# Altium schematic sheet SAMA7D65_PMIC.SchDoc
size A3; SheetNumber: 6; SheetTotal: 23
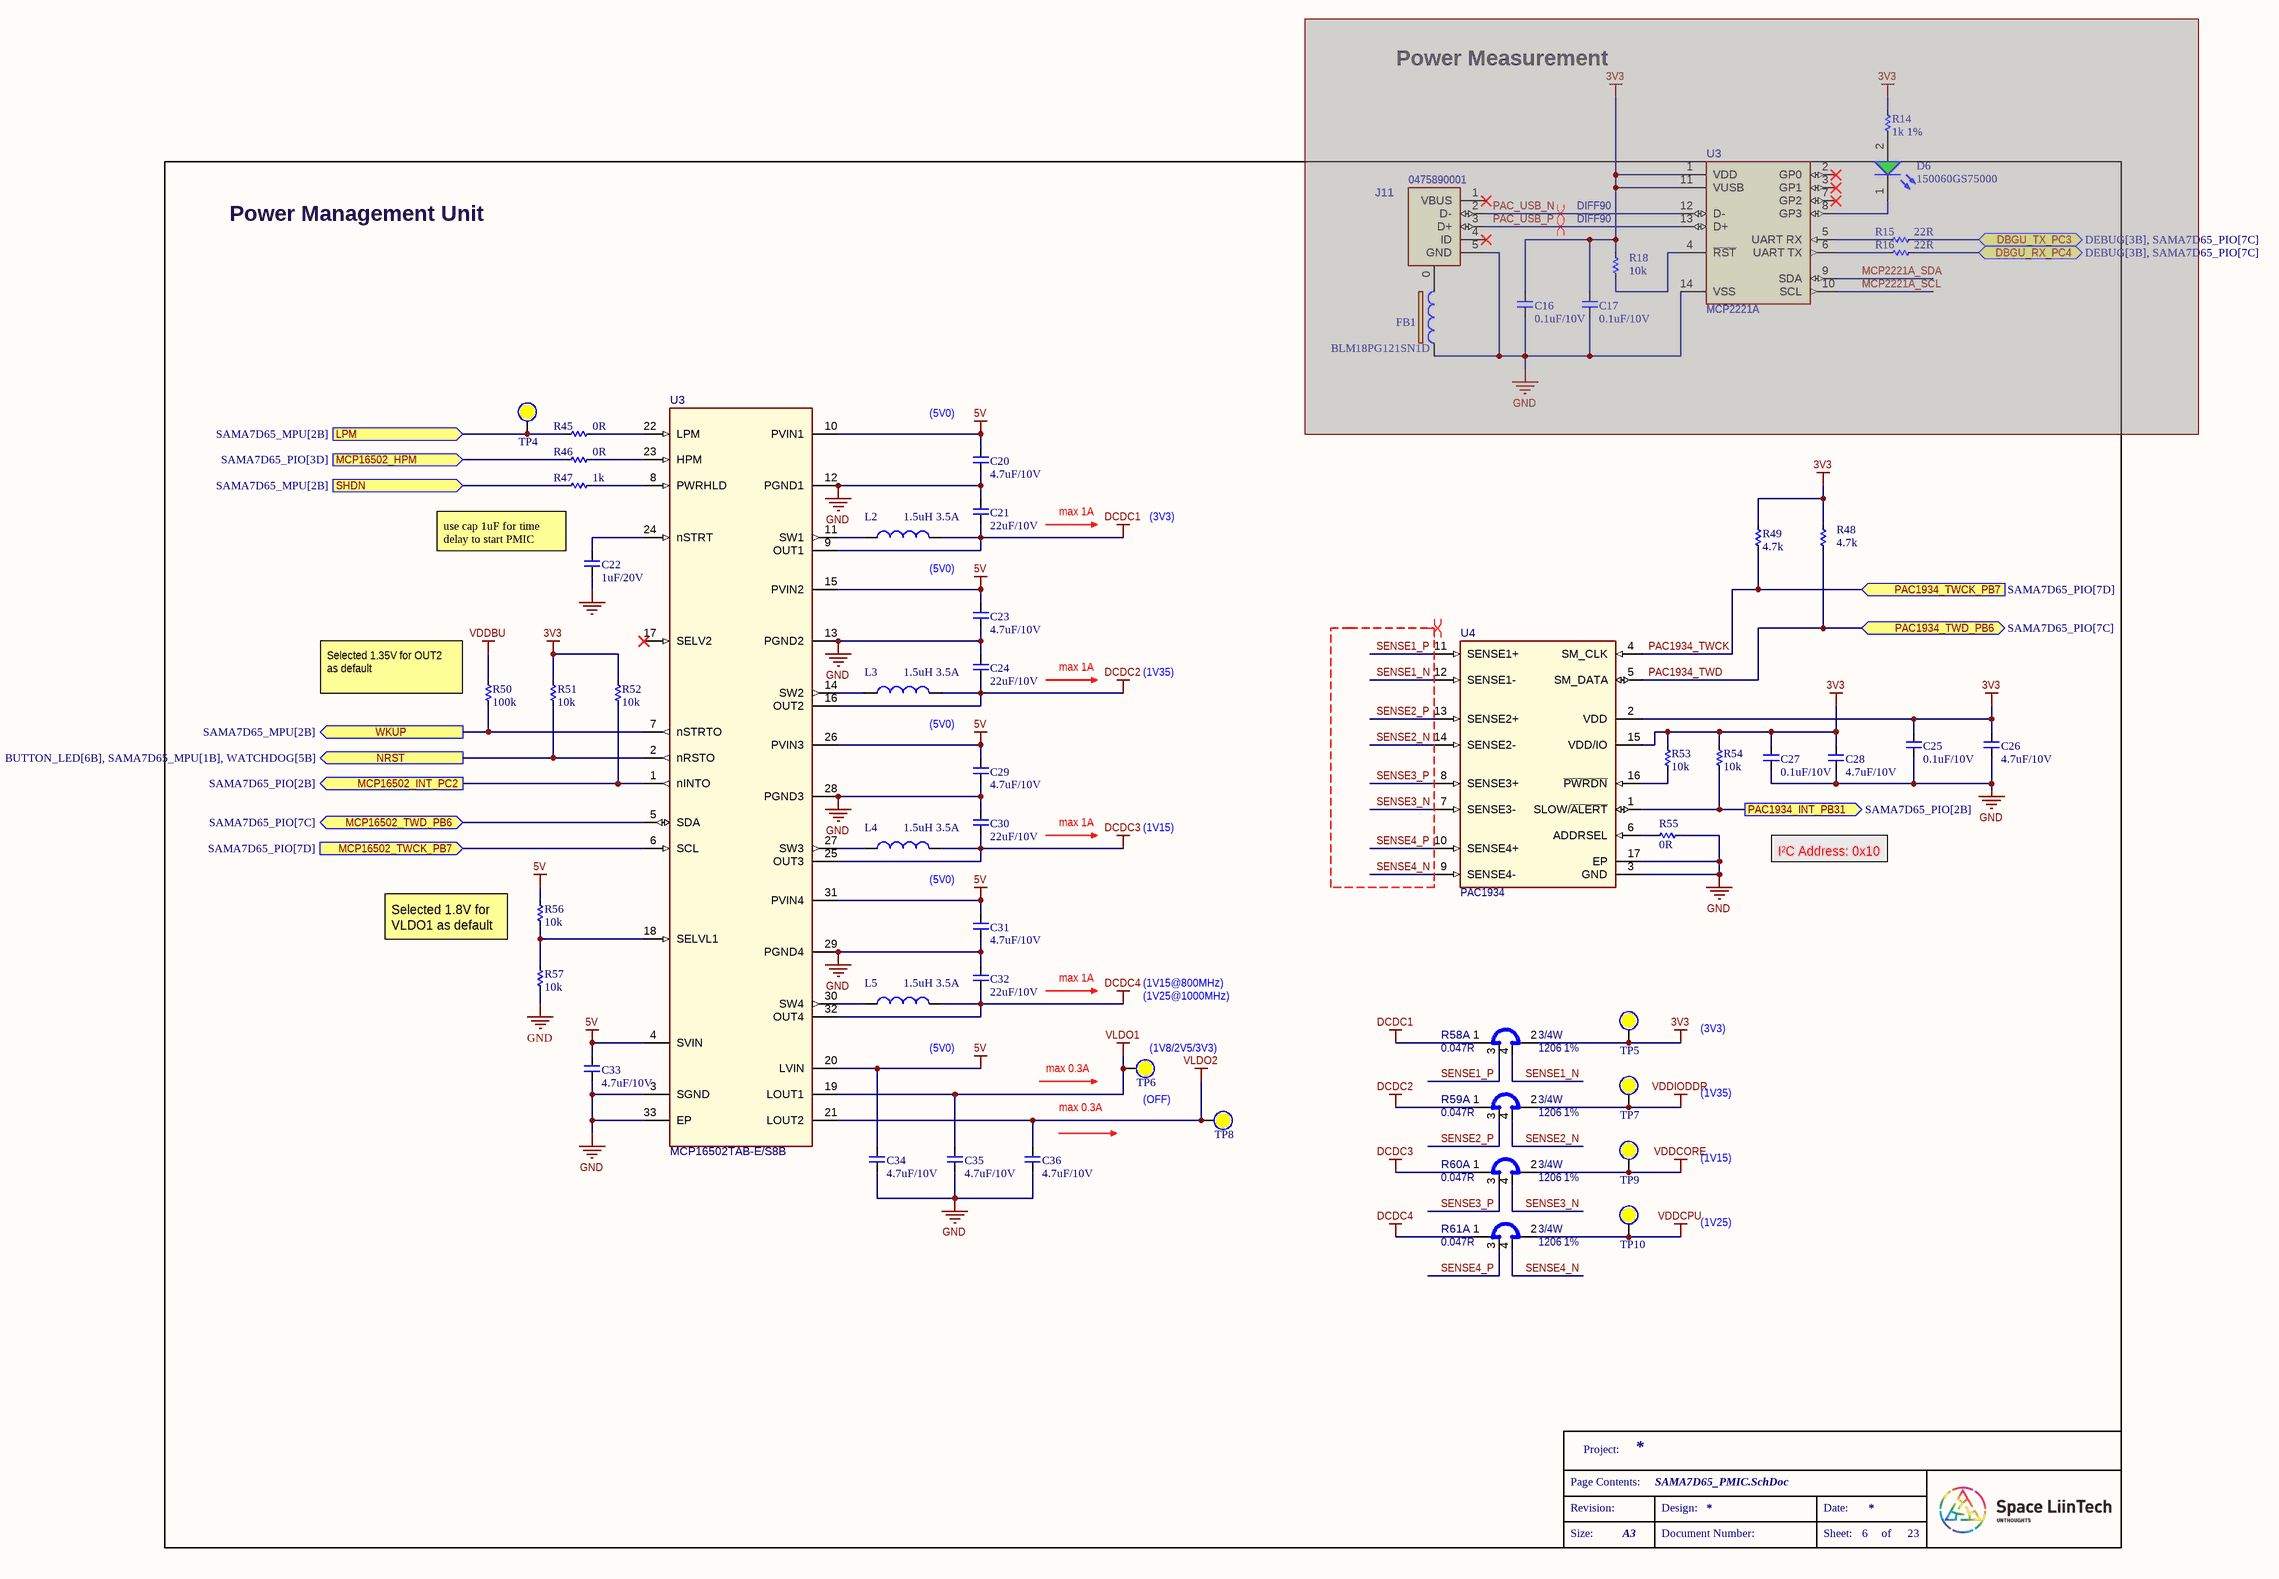
[diagram p0: SAMA7D65_PMIC.SchDoc]

## Parts
(Parts that share a designator on the sheet are numbered #1, #2 ... from top to bottom, then left to right.)
C16  0.1uF/10V  [CAP_C_1005X60]  (masked out: inside a compile mask, not in the netlist)
C17  0.1uF/10V  [CAP_C_1005X60]  (masked out: inside a compile mask, not in the netlist)
C20  4.7uF/10V  [CAP_C_1005X50_L]
C21  22uF/10V  [CAP_C_1608X80]
C22  1uF/20V  [CAP_C_1005X50_L]
C23  4.7uF/10V  [CAP_C_1005X50_L]
C24  22uF/10V  [CAP_C_1608X80]
C25  0.1uF/10V  [CAP_C_1005X50_L]
C26  4.7uF/10V  [CAP_C_1005X50_L]
C27  0.1uF/10V  [CAP_C_1005X50_L]
C28  4.7uF/10V  [CAP_C_1005X50_L]
C29  4.7uF/10V  [CAP_C_1005X50_L]
C30  22uF/10V  [CAP_C_1608X80]
C31  4.7uF/10V  [CAP_C_1005X50_L]
C32  22uF/10V  [CAP_C_1608X80]
C33  4.7uF/10V  [CAP_C_1005X50_L]
C34  4.7uF/10V  [CAP_C_1005X50_L]
C35  4.7uF/10V  [CAP_C_1005X50_L]
C36  4.7uF/10V  [CAP_C_1005X50_L]
D6  150060GS75000  [LED-0603-GREEN]  (masked out: inside a compile mask, not in the netlist)
FB1  BLM18PG121SN1D  [IND_BLM18_0603_MUR]  (masked out: inside a compile mask, not in the netlist)
J11  value 0475890001  [CON_USB_Micro-AB_SMD_RA_MOLEX_0475890001]  (hidden comment: CON USB2.0 Mini_Micro)  (masked out: inside a compile mask, not in the netlist)
L2  1.5uH 3.5A  [IND_C_1008]
L3  1.5uH 3.5A  [IND_C_1008]
L4  1.5uH 3.5A  [IND_C_1008]
L5  1.5uH 3.5A  [IND_C_1008]
R14  1k 1%  [RES_C_1005x30_L]  (masked out: inside a compile mask, not in the netlist)
R15  22R  [RES_C_1005x30_L]  (masked out: inside a compile mask, not in the netlist)
R16  22R  [RES_C_1005x30_L]  (masked out: inside a compile mask, not in the netlist)
R18  10k  [RES_C_1005x30_L]  (masked out: inside a compile mask, not in the netlist)
R45  0R  [RES_C_1005x30_L]
R46  0R  [RES_C_1005x30_L]
R47  1k  [RES_C_1005x30_L]
R48  4.7k  [RES_C_1005x30_L]
R49  4.7k  [RES_C_1005x30_L]
R50  100k  [RES_C_1005x30_L]
R51  10k  [RES_C_1005x30_L]
R52  10k  [RES_C_1005x30_L]
R53  10k  [RES_C_1005x30_L]
R54  10k  [RES_C_1005x30_L]
R55  0R  [RES_C_1005x30_L]
R56  10k  [RES_C_1005x30_L]
R57  10k  [RES_C_1005x30_L]
R58  value 0.047R  Package: 1206  Tolerance: 1%  Power: 3/4W  [RES_C_1206_SHUNT]  (hidden comment: Shunt 4 Pin)  (part A of 2)
R59  value 0.047R  Package: 1206  Tolerance: 1%  Power: 3/4W  [RES_C_1206_SHUNT]  (hidden comment: Shunt 4 Pin)  (part A of 2)
R60  value 0.047R  Package: 1206  Tolerance: 1%  Power: 3/4W  [RES_C_1206_SHUNT]  (hidden comment: Shunt 4 Pin)  (part A of 2)
R61  value 0.047R  Package: 1206  Tolerance: 1%  Power: 3/4W  [RES_C_1206_SHUNT]  (hidden comment: Shunt 4 Pin)  (part A of 2)
TP4  (no value)  [Test point]  (no BOM)
TP5  (no value)  [Test point]  (no BOM)
TP6  (no value)  [Test point]  (no BOM)
TP7  (no value)  [Test point]  (no BOM)
TP8  (no value)  [Test point]  (no BOM)
TP9  (no value)  [Test point]  (no BOM)
TP10  (no value)  [Test point]  (no BOM)
U3#1  value MCP2221A  [SOIC-14]  (hidden comment: MCP2221 SOIC-14_TSSOP-14_PDIP-14)  (masked out: inside a compile mask, not in the netlist)
U3#2  value MCP16502TAB-E/S8B  [QFN-32_5X5_EP3.7X3.7]  (hidden comment: MCP16502 QFN-32)
U4  value PAC1934  [UQFN-16_4X4_EP2.6X2.6]  (hidden comment: Microchip PAC1934 UQFN-16)

## Ports
DBGU_RX_PC4 (bidir, see DEBUG[3B], SAMA7D65_PIO[7C]), DBGU_TX_PC3 (bidir, see DEBUG[3B], SAMA7D65_PIO[7C]), LPM (in, see SAMA7D65_MPU[2B]), MCP16502_HPM (in, see SAMA7D65_PIO[3D]), MCP16502_INT_PC2 (out, see SAMA7D65_PIO[2B]), MCP16502_TWCK_PB7 (in, see SAMA7D65_PIO[7D]), MCP16502_TWD_PB6 (bidir, see SAMA7D65_PIO[7C]), NRST (out, see BUTTON_LED[6B], SAMA7D65_MPU[1B], WATCHDOG[5B]), PAC1934_INT_PB31 (out, see SAMA7D65_PIO[2B]), PAC1934_TWCK_PB7 (in, see SAMA7D65_PIO[7D]), PAC1934_TWD_PB6 (bidir, see SAMA7D65_PIO[7C]), SHDN (in, see SAMA7D65_MPU[2B]), WKUP (out, see SAMA7D65_MPU[2B])

## Nets
3V3: C25.2 C26.2 C27.2 C28.2 R48.1 R49.1 R51.2 R52.2 R53.2 R54.2 R58.2 TP5.0 U4.2(VDD) U4.15(VDD/IO)
5V: C20.2 C23.2 C29.2 C31.2 C33.2 C34.2 R56.2 U3#2.4(SVIN) U3#2.10(PVIN1) U3#2.15(PVIN2) U3#2.20(LVIN) U3#2.26(PVIN3) U3#2.31(PVIN4)
DCDC1: C21.1 L2.2 R58.1 U3#2.9(OUT1)
DCDC2: C24.1 L3.2 R59.1 U3#2.16(OUT2)
DCDC3: C30.1 L4.2 R60.1 U3#2.25(OUT3)
DCDC4: C32.1 L5.2 R61.1 U3#2.32(OUT4)
GND: C20.1 C21.2 C22.1 C23.1 C24.2 C25.1 C26.1 C27.1 C28.1 C29.1 C30.2 C31.1 C32.2 C33.1 C34.1 C35.1 C36.1 R55.2 R57.1 U3#2.3(SGND) U3#2.12(PGND1) U3#2.13(PGND2) U3#2.28(PGND3) U3#2.29(PGND4) U3#2.33(EP) U4.3(GND) U4.17(EP)
VDDBU: R50.2
VDDCORE: R60.2 TP9.0
VDDCPU: R61.2 TP10.0
VDDIODDR: R59.2 TP7.0
VLDO1: C35.2 TP6.0 U3#2.19(LOUT1)
VLDO2: C36.2 TP8.0 U3#2.21(LOUT2)
LPM: R45.1 TP4.0 ; port LPM
MCP16502_HPM: R46.1 ; port MCP16502_HPM
MCP16502_INT_PC2: R52.1 U3#2.1(nINTO) ; port MCP16502_INT_PC2
MCP16502_TWCK_PB7: U3#2.6(SCL) ; port MCP16502_TWCK_PB7
MCP16502_TWD_PB6: U3#2.5(SDA) ; port MCP16502_TWD_PB6
NRST: R51.1 U3#2.2(nRSTO) ; port NRST
PAC1934_INT_PB31: R54.1 U4.1(SLOW/~{ALERT}) ; port PAC1934_INT_PB31
PAC1934_TWCK: R49.2 U4.4(SM_CLK) ; port PAC1934_TWCK_PB7
PAC1934_TWD: R48.2 U4.5(SM_DATA) ; port PAC1934_TWD_PB6
SENSE1_N: R58.4 U4.12(SENSE1-)
SENSE1_P: R58.3 U4.11(SENSE1+)
SENSE2_N: R59.4 U4.14(SENSE2-)
SENSE2_P: R59.3 U4.13(SENSE2+)
SENSE3_N: R60.4 U4.7(SENSE3-)
SENSE3_P: R60.3 U4.8(SENSE3+)
SENSE4_N: R61.4 U4.9(SENSE4-)
SENSE4_P: R61.3 U4.10(SENSE4+)
SHDN: R47.1 ; port SHDN
WKUP: R50.1 U3#2.7(nSTRTO) ; port WKUP
NetC22_2: C22.2 U3#2.24(nSTRT)
NetL2_1: L2.1 U3#2.11(SW1)
NetL3_1: L3.1 U3#2.14(SW2)
NetL4_1: L4.1 U3#2.27(SW3)
NetL5_1: L5.1 U3#2.30(SW4)
NetR45_2: R45.2 U3#2.22(LPM)
NetR46_2: R46.2 U3#2.23(HPM)
NetR47_2: R47.2 U3#2.8(PWRHLD)
NetR53_1: R53.1 U4.16(~{PWRDN})
NetR55_1: R55.1 U4.6(ADDRSEL)
NetR56_1: R56.1 R57.2 U3#2.18(SELVL1)

Not connected (* = marked no-connect by the designer): U3#2 17(SELV2)*

## Layout directives
differential pair: SENSE1_N, SENSE1_P, SENSE2_N, SENSE2_P, SENSE3_N, SENSE3_P, SENSE4_N, SENSE4_P
differential pair; differential pair class DIFF90; net class DIFF90; rule Matched Net Lengths [Tolerance = 4mil]: (no net found under the mark)

## Notes on the sheet
- Power Measurement
- Power Management Unit
- (near C20) (5V0)
- use cap 1uF for time delay to start PMIC
- max 1A
- (3V3)
- (near L2) (5V0)
- (near R50) Selected 1.35V for OUT2 as default
- (1V35)
- (near L3) (5V0)
- (near L4) (5V0)
- (1V15)
- I²C Address: 0x10
- Selected 1.8V for VLDO1 as default
- (1V15@800MHz)
- (1V25@1000MHz)
- (near L5) (5V0)
- (near TP6) max 0.3A
- (near TP6) (1V8/2V5/3V3)
- max 0.3A
- (near TP6) (OFF)
- (1V25)
- Project:
- Page Contents:
- Revision:
- Design:
- Date:
- Size:
- A3
- Document Number:
- Sheet:
- of

## Library data of the parts
C16 C17 C20-C36 = _CAP_C_2: CAP CHIP
D6 = LED_GREEN: LED GREEN CLEAR 0603 SMD
FB1 = BLM18PG121SN1D: FERRITE BEAD 120 OHM 0603 1LN; Manufacturer_Name: Murata; Copyright: Copyright (C) 2025 Ultra Librarian. All rights reserved.; Manufacturer_Part_Number: BLM18PG121SN1D
J11 = 0475890001: CONN RCPT MICRO USB AB 5P SMD RA; Manufacturer 1: Molex, LLC; MCHP-ID: CON1753; Description_: CON USB2.0 MICRO-AB FEMALE SMD R/A; Dev Tools Status: Production; Owner: Dragos Danaila; Voltage: 30VAC; Current: 1A, 1.8A; Custom Parameters: 10000 mating cycles; Populated: YES; Revision: 1; Symbol: CON USB2.0 Mini_Micro; Status: MCL Design; ComponentLink1URL: https://chn-vm-apps.microchip.com/mchprepo/parts/Datasheets/475890001_sd.pdf; ComponentLink1Description: SVN Datasheet; ComponentLink2URL: C:\ALTIUM_WORK\00001_MCHP-CDB\Datasheets\475890001_sd.pdf; ComponentLink2Description: Local Datasheet; ComponentLink3URL: C:\ALTIUM_WORK\00001_MCHP-CDB\Library\LibraryRefs\CON USB2.0 Mini_Micro.SchLib; ComponentLink3Description: Open Symbol; ComponentLink4URL: C:\ALTIUM_WORK\00001_MCHP-CDB\Library\Footprints\CON_USB_Micro-AB_SMD_RA_MOLEX_0475890001.PcbLib; ComponentLink4Description: Open Footprint; ComponentLink5Description: Open Footprint 2; ComponentLink6Description: Open Footprint 3; ComponentLink7Description: Open Footprint 4; Type: USB; Category: Connector; Manufacturer Part Number 1: 0475890001; Supplier 1: Digi-Key; Supplier Part Number 1: WM17143CT-ND; Quantity Override: 1; Operating Temperature: -35C to +85C; Assembly Type: SMD
L2-L5 = DFE252012P-1R5M=P2: Fixed Inductor 1.5uH 3.5A R060 SMD; Package: None; Price: None; Value: *; MP: DFE252012P-1R5M=P2; Availability: Unavailable
R14-R16 R18 R45-R57 = _RES_B_2: RES
R58-R61 = SHUNT: Shunt Resistor, RES 0.047 OHM 1% 3/4W 1206; Manufacturer 1: SUSUMU; Manufacturer Part Number 1: KRL1632E-M-R047-F-T5; MCHP-ID: RSMT1405; Description_: RES SHUNT MF 0.047R 1% 3/4W SMD 1206; Dev Tools Status: Design; Current: 4A; Owner: Ciprian Abramov; Populated: YES; Temperature Coefficient: ±50ppm/C; Restricted Sourcing: No; Revision: 1; Symbol: Shunt 4 Pin; Status: MCL Design; ComponentLink1URL: https://chn-vm-apps.microchip.com/mchprepo/parts/Datasheets/n_catalog_partition09_en.pdf; ComponentLink1Description: SVN Datasheet; ComponentLink2URL: C:\ALTIUM_WORK\00001_MCHP-CDB\Datasheets\n_catalog_partition09_en.pdf; ComponentLink2Description: Local Datasheet; ComponentLink3URL: C:\ALTIUM_WORK\00001_MCHP-CDB\Library\LibraryRefs\Shunt 4 Pin.SchLib; ComponentLink3Description: Open Symbol; ComponentLink4URL: C:\ALTIUM_WORK\00001_MCHP-CDB\Library\Footprints\RES_C_1206_SHUNT.PcbLib; ComponentLink4Description: Open Footprint; ComponentLink5Description: Open Footprint 2; ComponentLink6Description: Open Footprint 3; ComponentLink7Description: Open Footprint 4; Operating Temperature: -55C to 155C; Category: Resistor; Type: Shunt; Composition: MF; Supplier 1: Digi-Key; Supplier Part Number 1: 408-1578-2-ND; Quantity Override: 1
TP4-TP10 = Test Point: Solder: NF
U3#1 = MCP2221A-I/SL: IC USB TO I2C/UART 14SOIC; Manufacturer 1: Microchip Technology; MCHP-ID: MIC9078; Description_: MCHP INTERFACE USB I2C UART MCP2221A-I/SL SOIC-14; Dev Tools Status: Design; Owner: Octavian Stroe; Populated: YES; Symbol: MCP2221 SOIC-14_TSSOP-14_PDIP-14; Type: USB; Status: MCL Design; Revision: A; Category: MCHP-Interface; ComponentLink1URL: https://chn-vm-apps.microchip.com/mchprepo/parts/Datasheets/20005292B.pdf; ComponentLink1Description: SVN Datasheet; ComponentLink2URL: C:\ALTIUM_WORK\00001_MCHP-CDB\Datasheets\20005292B.pdf; ComponentLink2Description: Local Datasheet; ComponentLink3URL: C:\ALTIUM_WORK\00001_MCHP-CDB\Library\LibraryRefs\MCP2221 SOIC-14_TSSOP-14_PDIP-14.SchLib; ComponentLink3Description: Open Symbol; ComponentLink4URL: C:\ALTIUM_WORK\00001_MCHP-CDB\Library\Footprints\SOIC-14.PcbLib; ComponentLink4Description: Open Footprint; ComponentLink5Description: Open Footprint 2; ComponentLink6Description: Open Footprint 3; ComponentLink7Description: Open Footprint 4; Manufacturer Part Number 1: MCP2221A-I/SL; Manufacturer 2: Microchip Technology; Manufacturer Part Number 2: MCP2221A-I/SL; Supplier 1: Digi-Key; Supplier Part Number 1: MCP2221A-I/SL-ND; Supplier 2: Mouser; Supplier Part Number 2: 579-MCP2221A-I/SL; Operating Temperature: -40C to +85C; Quantity Override: 1
U3#2 = MIC8878: Manufacturer 1: Microchip Technology; Populated: YES; Description_: MCHP ANALOG PMIC SWITCHER Buck ADJ MCP16502TAB-E/S8B QFN-32 for SAMA7G5 MPU with LPDDR/DDR2/DDR3; Dev Tools Status: Design; Owner: Dragos Danaila; MCHP-ID: MIC8878; Symbol: MCP16502 QFN-32; Type: Switcher; Status: MCL Design; Revision: 1; Category: MCHP-Analog; ComponentLink1Description: SVN Datasheet; ComponentLink2Description: Local Datasheet; ComponentLink3URL: C:\ALTIUM_WORK\00001_MCHP-CDB\Library\LibraryRefs\MCP16502 QFN-32.SchLib; ComponentLink3Description: Open Symbol; ComponentLink4URL: C:\ALTIUM_WORK\00001_MCHP-CDB\Library\Footprints\QFN-32_5X5_EP3.7X3.7.PcbLib; ComponentLink4Description: Open Footprint; ComponentLink5Description: Open Footprint 2; ComponentLink6Description: Open Footprint 3; ComponentLink7Description: Open Footprint 4; Manufacturer Part Number 1: MCP16502TAB-E/S8B; Supplier 1: Digi-Key; Supplier Part Number 1: 150-MCP16502TAB-E/S8BCT-ND; Quantity Override: 1; ComponentLink2URL: C:\ALTIUM_WORK\00001_MCHP-CDB\Datasheets\MCP16502-High-Performance-PMIC-for-SAMA5DX-SAM9X6-MPUs-Data-Sheet-DS20006275B.pdf
U4 = PAC1934T-I/JQ: IC CURRENT MONITOR 1% 16UQFN; Manufacturer 1: Microchip Technology; MCHP-ID: MIC7010; Description_: MCHP ANALOG POWER CURRENT SENSE MONITOR PAC1934T-I/JQ UQFN-16; Dev Tools Status: Production; Owner: Razvan Cristescu; Populated: YES; Restricted Sourcing: No; Symbol: PAC1934 UQFN-16; Type: Power/Current Sensor; Status: MCL Design; Revision: 2; Category: MCHP-Analog; ComponentLink1Description: SVN Datasheet; ComponentLink2Description: Local Datasheet; ComponentLink3URL: C:\ALTIUM_WORK\00001_MCHP-CDB\Library\LibraryRefs\PAC1934 UQFN-16.SchLib; ComponentLink3Description: Open Symbol; ComponentLink4URL: C:\ALTIUM_WORK\00001_MCHP-CDB\Library\Footprints\UQFN-16_4X4_EP2.6X2.6.PcbLib; ComponentLink4Description: Open Footprint; ComponentLink5Description: Open Footprint 2; ComponentLink6Description: Open Footprint 3; ComponentLink7Description: Open Footprint 4; Manufacturer Part Number 1: PAC1934T-I/JQ; Supplier 1: Microchip Technology; Supplier Part Number 1: PAC1934T-I/JQ; Quantity Override: 1; ComponentLink1URL: https://www.microchip.com/sitesearch/search/Product%20and%20Development%20Tools/PAC1934T-I/JQ; Operating Temperature: -40C to +85C